# Altium project MainBoard.PrjPcb
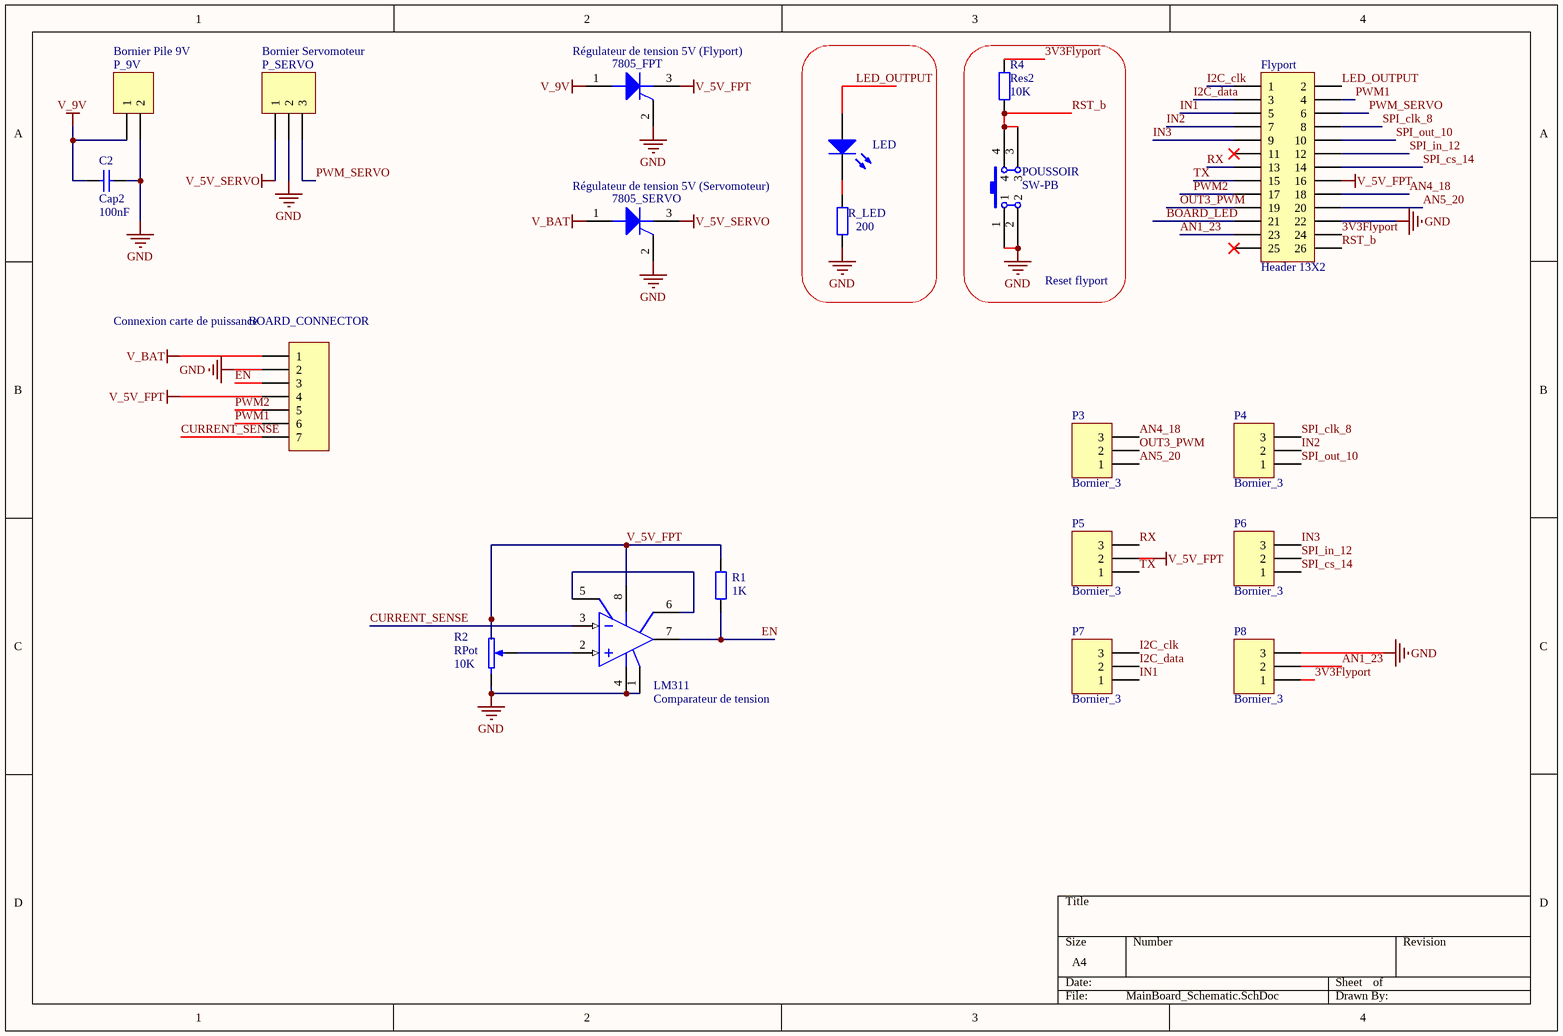
[diagram p0: MainBoard_Schematic.SchDoc]
1 sheet, 20 parts. Net scope: global (net labels, ports and power ports of the same name join across sheets).
Board file: MainBoard_PCB_spaced.PcbDoc

## Sheet MainBoard_Schematic.SchDoc
size A4

### Parts
7805_FPT  Régulateur de tension 5V (Flyport)  [TO-220-AB]
7805_SERVO  Régulateur de tension 5V (Servomoteur)  [TO-220-AB]
BOARD_CONNECTOR  Connexion carte de puissance  [HDR1X7]
C2  Cap2  value 100nF  [CAPA2]
Flyport  Header 13X2  [HDR2X13]
LED  Led  [LED]  (value not drawn)
LM311  Comparateur de tension  [DIP8]
P3  Bornier_3  [Bornier_3]
P4  Bornier_3  [Bornier_3]
P5  Bornier_3  [Bornier_3]
P6  Bornier_3  [Bornier_3]
P7  Bornier_3  [Bornier_3]
P8  Bornier_3  [Bornier_3]
P_9V  Bornier Pile 9V  [Bornier_2]
P_SERVO  Bornier Servomoteur  [Bornier_3]
POUSSOIR  SW-PB  [SW_BP]
R1  value 1K  [res5_1/4W]  (hidden comment: Res2)
R2  RPot  value 10K  [AJUSTABLE]
R4  Res2  value 10K  [res5_1/4W]
R_LED  value 200  [res5_1/4W]

### Blocks framed on the sheet
Reset flyport: POUSSOIR R4

### Nets
GND: 7805_FPT.2(GND) 7805_SERVO.2(GND) BOARD_CONNECTOR.2 C2.2 Flyport.22 LM311.1(GND) LM311.4(V-_(CASE)) P8.3 P_9V.2 P_SERVO.2 POUSSOIR.1 POUSSOIR.2 R2.3(TOP) R_LED.2
V_5V_FPT: 7805_FPT.3(OUT) BOARD_CONNECTOR.4 Flyport.16 LM311.8(V+) P5.2 R1.2 R2.1(BOT)
V_5V_SERVO: 7805_SERVO.3(OUT) P_SERVO.1
V_9V: 7805_FPT.1(IN) C2.1 P_9V.1
V_BAT: 7805_SERVO.1(IN) BOARD_CONNECTOR.1
3V3Flyport: Flyport.24 P8.1 R4.1
AN1_23: Flyport.23 P8.2
AN4_18: Flyport.18 P3.3
AN5_20: Flyport.20 P3.1
BOARD_LED: Flyport.21
CURRENT_SENSE: BOARD_CONNECTOR.7 LM311.3(IN-)
EN: BOARD_CONNECTOR.3 LM311.7(OUT) R1.1
I2C_clk: Flyport.1 P7.3
I2C_data: Flyport.3 P7.2
IN1: Flyport.5 P7.1
IN2: Flyport.7 P4.2
IN3: Flyport.9 P6.3
LED_OUTPUT: Flyport.2 LED.1(A)
OUT3_PWM: Flyport.19 P3.2
PWM1: BOARD_CONNECTOR.6 Flyport.4
PWM2: BOARD_CONNECTOR.5 Flyport.17
PWM_SERVO: Flyport.6 P_SERVO.3
RST_b: Flyport.26 POUSSOIR.3 POUSSOIR.4 R4.2
RX: Flyport.13 P5.3
SPI_clk_8: Flyport.8 P4.3
SPI_cs_14: Flyport.14 P6.1
SPI_in_12: Flyport.12 P6.2
SPI_out_10: Flyport.10 P4.1
TX: Flyport.15 P5.1
NetLED_2: LED.2(K) R_LED.1
NetLM311_2: LM311.2(IN+) R2.2(TAP)
NetLM311_5: LM311.5(BAL) LM311.6(BAL/STB)

Not connected (* = marked no-connect by the designer): Flyport 11* 25*

### Library data of the parts
7805_FPT 7805_SERVO = SCR: Silicon Controlled Rectifier; Published: 8-Jun-2000; LatestRevisionDate: 17-Jul-2002; LatestRevisionNote: Re-released for DXP Platform.; PackageReference: TO-220-AB; Publisher: Altium Limited; Code_JEDEC: TO-220-AB
BOARD_CONNECTOR = Header 7: Header, 7-Pin; LatestRevisionDate: 17-Jul-2002; LatestRevisionNote: Re-released for DXP Platform.; Publisher: Altium Limited
C2 = Cap2: Capacitor; Published: 8-Jun-2000; LatestRevisionDate: 17-Jul-2002; LatestRevisionNote: Re-released for DXP Platform.; PackageReference: RAD-0.3; Publisher: Altium Limited
Flyport = Header 13X2: Header, 13-Pin, Dual row; LatestRevisionDate: 17-Jul-2002; LatestRevisionNote: Re-released for DXP Platform.; Publisher: Altium Limited
LM311 = LM311N: Voltage Comparator; Published: 24-Aug-2001; LatestRevisionDate: 06-Jun-2005; LatestRevisionNote: Stylized 3D Model Added.; DatasheetVersion: Oct-1997; PackageReference: DIP8; Publisher: Altium Limited; PackageDescription: DIP; 8 Leads; Row Spacing 7.62 mm; Pitch 2.54 mm; Code_JEDEC: MO-001-AN; ComponentLink1Description: Manufacturer Link; ComponentLink1URL: http://www.st.com/; ComponentLink2Description: Datasheet; ComponentLink2URL: http://www.st.com/stonline/products/literature/ds/4848/lm211.pdf
P3-P8 P_SERVO = Bornier_3: Header, 3-Pin; LatestRevisionDate: 17-Jul-2002; LatestRevisionNote: Re-released for DXP Platform.; Publisher: Altium Limited
P_9V = Bornier_2: Header, 2-Pin; LatestRevisionDate: 17-Jul-2002; LatestRevisionNote: Re-released for DXP Platform.; Publisher: Altium Limited
POUSSOIR = SW-PB: Switch; Published: 24-Mar-1999; LatestRevisionDate: 17-Jul-2002; LatestRevisionNote: Re-released for DXP Platform.; PackageReference: SPST-2; Publisher: Altium Limited
R1 R4 R_LED = Res2: Resistor; Published: 8-Jun-2000; LatestRevisionDate: 17-Jul-2002; LatestRevisionNote: Re-released for DXP Platform.; PackageReference: AXIAL-0.4; Publisher: Altium Limited
R2 = RPot: Potentiometer; Sim Note: Enter the Resistance value and the set point into parameter fields.; Set Position: 0.5; Published: 8-Jun-2000; LatestRevisionDate: 17-Jul-2002; LatestRevisionNote: Re-released for DXP Platform.; PackageReference: VR5; Publisher: Altium Limited
LED = Led: Published: 8-Jun-2000; LatestRevisionDate: 17-Jul-2002; LatestRevisionNote: Re-released for DXP Platform.; DatasheetDocument: 1998; PackageDocument: Aug-1999; PackageReference: DO-41; Publisher: Altium Limited; Code_JEDEC: DO-204-AL; ComponentLink1Description: Manufacturer Link; ComponentLink1URL: http://www.fairchildsemi.com/; ComponentLink2Description: Datasheet; ComponentLink2URL: http://www.fairchildsemi.com/ds/1N%2F1N4001.pdf